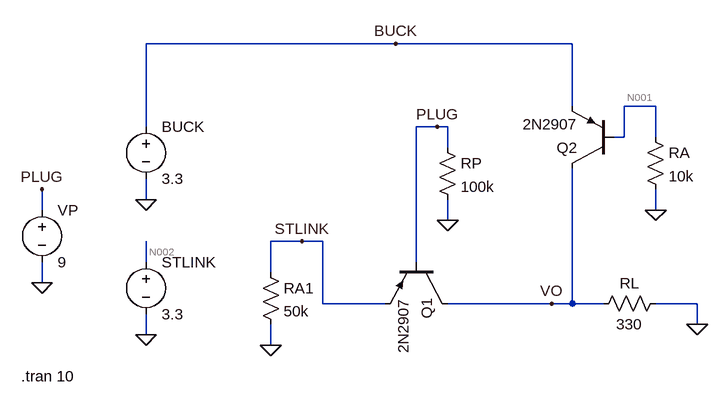
[diagram p0: schematic A2.asc]
A2.asc, the LTspice schematic file:
Version 4
SHEET 1 932 680
WIRE 448 -64 64 -64
WIRE 720 -64 448 -64
WIRE 720 32 720 -64
WIRE 848 32 800 32
WIRE 64 64 64 -64
WIRE 512 64 480 64
WIRE 528 64 512 64
WIRE 800 80 800 32
WIRE 800 80 784 80
WIRE 848 80 848 32
WIRE 528 96 528 64
WIRE 64 176 64 144
WIRE -96 192 -96 160
WIRE 848 192 848 160
WIRE 528 208 528 176
WIRE 304 240 256 240
WIRE 336 240 304 240
WIRE 64 272 64 240
WIRE 480 272 480 64
WIRE 256 288 256 240
WIRE -96 304 -96 272
WIRE 336 336 336 240
WIRE 432 336 336 336
WIRE 688 336 528 336
WIRE 720 336 720 128
WIRE 720 336 688 336
WIRE 768 336 720 336
WIRE 912 336 848 336
WIRE 912 368 912 336
WIRE 64 384 64 352
WIRE 256 400 256 368
FLAG -96 304 0
FLAG 64 384 0
FLAG 64 176 0
FLAG 912 368 0
FLAG -96 160 PLUG
FLAG 528 208 0
FLAG 512 64 PLUG
FLAG 848 192 0
FLAG 688 336 VO
FLAG 448 -64 BUCK
FLAG 304 240 STLINK
FLAG 256 400 0
SYMBOL voltage 64 48 R0
WINDOW 123 0 0 Left 0
WINDOW 39 0 0 Left 0
SYMATTR InstName BUCK
SYMATTR Value 3.3
SYMBOL voltage 64 256 R0
WINDOW 123 0 0 Left 0
WINDOW 39 0 0 Left 0
SYMATTR InstName STLINK
SYMATTR Value 3.3
SYMBOL voltage -96 176 R0
WINDOW 123 0 0 Left 0
WINDOW 39 0 0 Left 0
SYMATTR InstName VP
SYMATTR Value 9
SYMBOL res 864 320 R90
WINDOW 0 0 56 VBottom 2
WINDOW 3 32 56 VTop 2
SYMATTR InstName RL
SYMATTR Value 330
SYMBOL res 512 80 R0
SYMATTR InstName RP
SYMATTR Value 100k
SYMBOL res 832 64 R0
SYMATTR InstName RA
SYMATTR Value 10k
SYMBOL pnp 528 272 R90
SYMATTR InstName Q1
SYMATTR Value 2N2907
SYMBOL pnp 784 128 R180
SYMATTR InstName Q2
SYMATTR Value 2N2907
SYMBOL res 240 272 R0
SYMATTR InstName RA1
SYMATTR Value 50k
TEXT -128 448 Left 2 !.tran 10

The netlist it stands for:
* A2.asc
V§BUCK BUCK 0 3.3
V§STLINK N002 0 3.3
VP PLUG 0 9
RL 0 VO 330
RP PLUG 0 100k
RA N001 0 10k
Q1 VO PLUG STLINK 0 2N2907
Q2 VO N001 BUCK 0 2N2907
RA1 STLINK 0 50k
.model NPN NPN
.model PNP PNP
.lib standard.bjt
.tran 10
.backanno
.end

* Results of the author's LTspice run, read from the files saved beside the schematic
* Operating Point, zero values left out:
*   V(buck) = 3.3 V
*   V(n002) = 3.3 V
*   V(plug) = 9 V
*   V(vo) = 3.222 V
*   V(n001) = 2.578 V
*   V(stlink) = 900 nV
*   Ic(Q1) = -5.782 pA
*   Ib(Q1) = 14.78 pA
*   Ie(Q1) = -9 pA
*   Ic(Q2) = -9.762 mA
*   Ib(Q2) = -257.8 µA
*   Ie(Q2) = 10.02 mA
*   I(Rl) = -9.762 mA
*   I(Rp) = 90 µA
*   I(Ra) = 257.8 µA
*   I(Ra1) = 9 pA
*   I(Buck) = -10.02 mA
*   I(Vp) = -90 µA
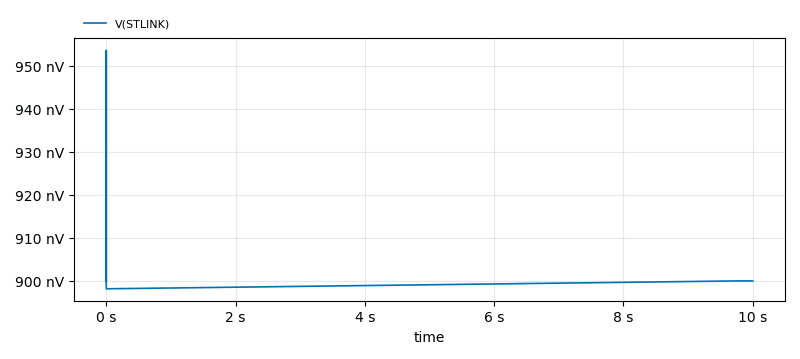
[diagram p1: Transient Analysis of A2.asc, plotted from the saved traces]
* Transient Analysis, 1 run:
*   V(STLINK): min 898.2 nV, max 953.6 nV, average 899.1 nV, rms 899.1 nV, last 900 nV